# EAGLE design ornithopter (EAGLE 9.6.2)
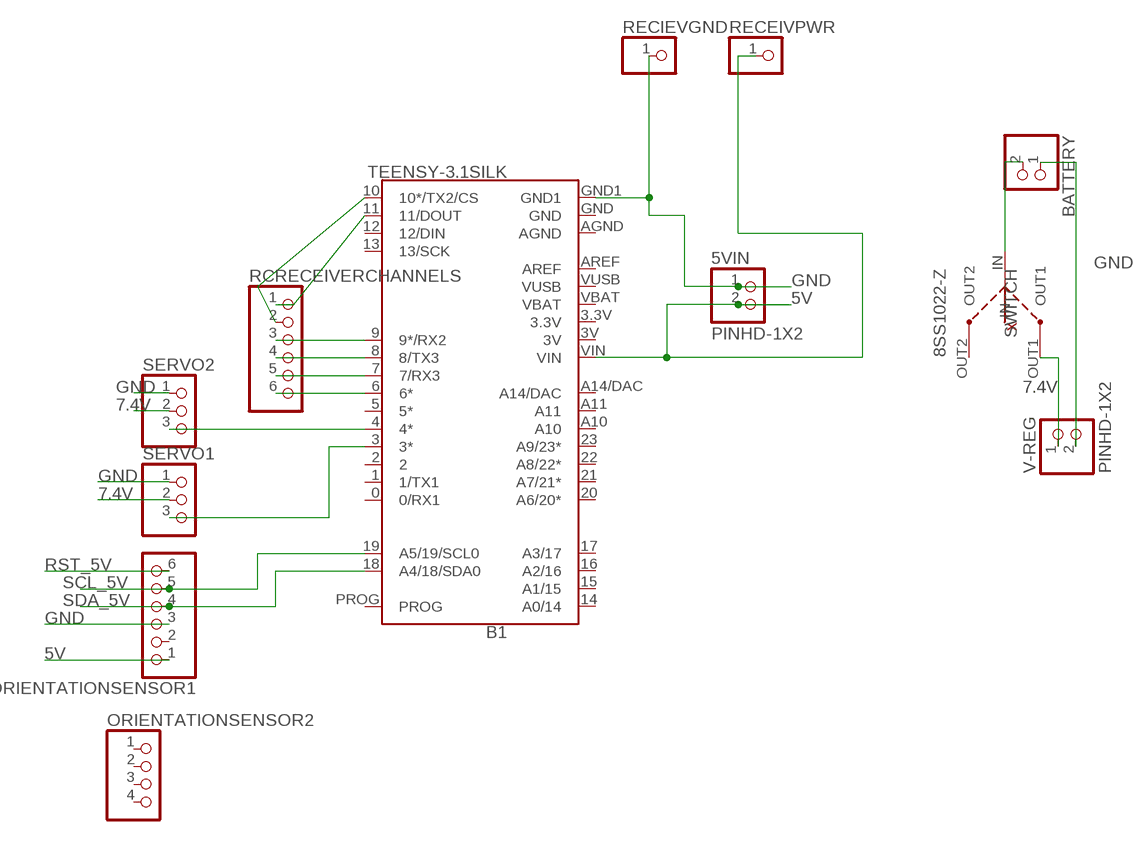
[diagram p0: schematic, sheet 1]

## Parts
5VIN  PINHD-1X2  [1X02]
B1  TEENSY-3.1SILK  [TEENSY-3.1]
BATTERY  PINHD-1X2  [1X02]
ORIENTATIONSENSOR1  HEADER-1X676MIL  [1X06_ROUND_76]
ORIENTATIONSENSOR2  HEADER-1X476MIL  [1X04_ROUND_76]
RCRECEIVERCHANNELS  PINHD-1X6  [1X06]
RECEIVPWR  PINHD-1X1  [1X01]
RECIEVGND  PINHD-1X1  [1X01]
SERVO1  PINHD-1X3CB  [1X03-CLEANBIG]
SERVO2  PINHD-1X3CB  [1X03-CLEANBIG]
SWITCH  8SS1022-Z  [8SS1022-Z]
V-REG  PINHD-1X2  [1X02]

## Nets
5V: 5VIN.2 B1.VIN ORIENTATIONSENSOR1.1 RECEIVPWR.1
7.4V: SERVO1.2 SERVO2.2 SWITCH.OUT1 V-REG.1
GND: 5VIN.1 B1.GND1 BATTERY.1 ORIENTATIONSENSOR1.3 RECIEVGND.1 SERVO1.1 SERVO2.1 V-REG.2
N$1: B1.11(11/DOUT) RCRECEIVERCHANNELS.1
N$2: B1.10(10*/TX2/CS) RCRECEIVERCHANNELS.2
N$3: B1.9(9*/RX2) RCRECEIVERCHANNELS.3
N$4: B1.8(8/TX3) RCRECEIVERCHANNELS.4
N$5: B1.7(7/RX3) RCRECEIVERCHANNELS.5
N$6: B1.6(6*) RCRECEIVERCHANNELS.6
N$7: B1.4(4*) SERVO2.3
N$8: B1.3(3*) SERVO1.3
N$9: BATTERY.2 SWITCH.IN
RST_5V: ORIENTATIONSENSOR1.6
SCL_5V: B1.19(A5/19/SCL0) ORIENTATIONSENSOR1.5
SDA_5V: B1.18(A4/18/SDA0) ORIENTATIONSENSOR1.4
Unconnected: B1.0(0/RX1) B1.1(1/TX1) B1.2 B1.5(5*) B1.12(12/DIN) B1.13(13/SCK) B1.14(A0/14) B1.15(A1/15) B1.16(A2/16) B1.17(A3/17) B1.20(A6/20*) B1.21(A7/21*) B1.22(A8/22*) B1.23(A9/23*) B1.A10 B1.A11 B1.A14/DAC B1.AREF B1.PROG ORIENTATIONSENSOR1.2 ORIENTATIONSENSOR2.1 ORIENTATIONSENSOR2.2 ORIENTATIONSENSOR2.3 ORIENTATIONSENSOR2.4 SWITCH.OUT2

## Power pins joined to a net without a drawn wire
3.3V: B1.3.3V
3V: B1.3V
AGND: B1.AGND
GND: B1.GND
VBAT: B1.VBAT
VUSB: B1.VUSB

## Library data of the parts
5VIN BATTERY V-REG = Connector:PINHD-1X2: PIN HEADER; CATEGORY: CONNECTOR; SUB-CATEGORY: PIN-HEADER
B1 = SparkFun-Boards:TEENSY-3.1: Teensy 3+ Footprint Mechanical footprint with connectors for Teensy Development Board with ARM Cortex. SparkFun Products: Teensy 3.2 <https://www.sparkfun.com/products/13736> Teensy LC <https://www.sparkfun.com/products/13305>; SF_ID: DEV-12646
ORIENTATIONSENSOR1 = microbuilder:HEADER-1X6: PIN HEADER
ORIENTATIONSENSOR2 = microbuilder:HEADER-1X4: PIN HEADER
RCRECEIVERCHANNELS = adafruit:PINHD-1X6: PIN HEADER
RECEIVPWR RECIEVGND = pinhead:PINHD-1X1: PIN HEADER
SERVO1 SERVO2 = adafruit:PINHD-1X3: PIN HEADER
SWITCH = ornithopter:8SS1022-Z

## Board
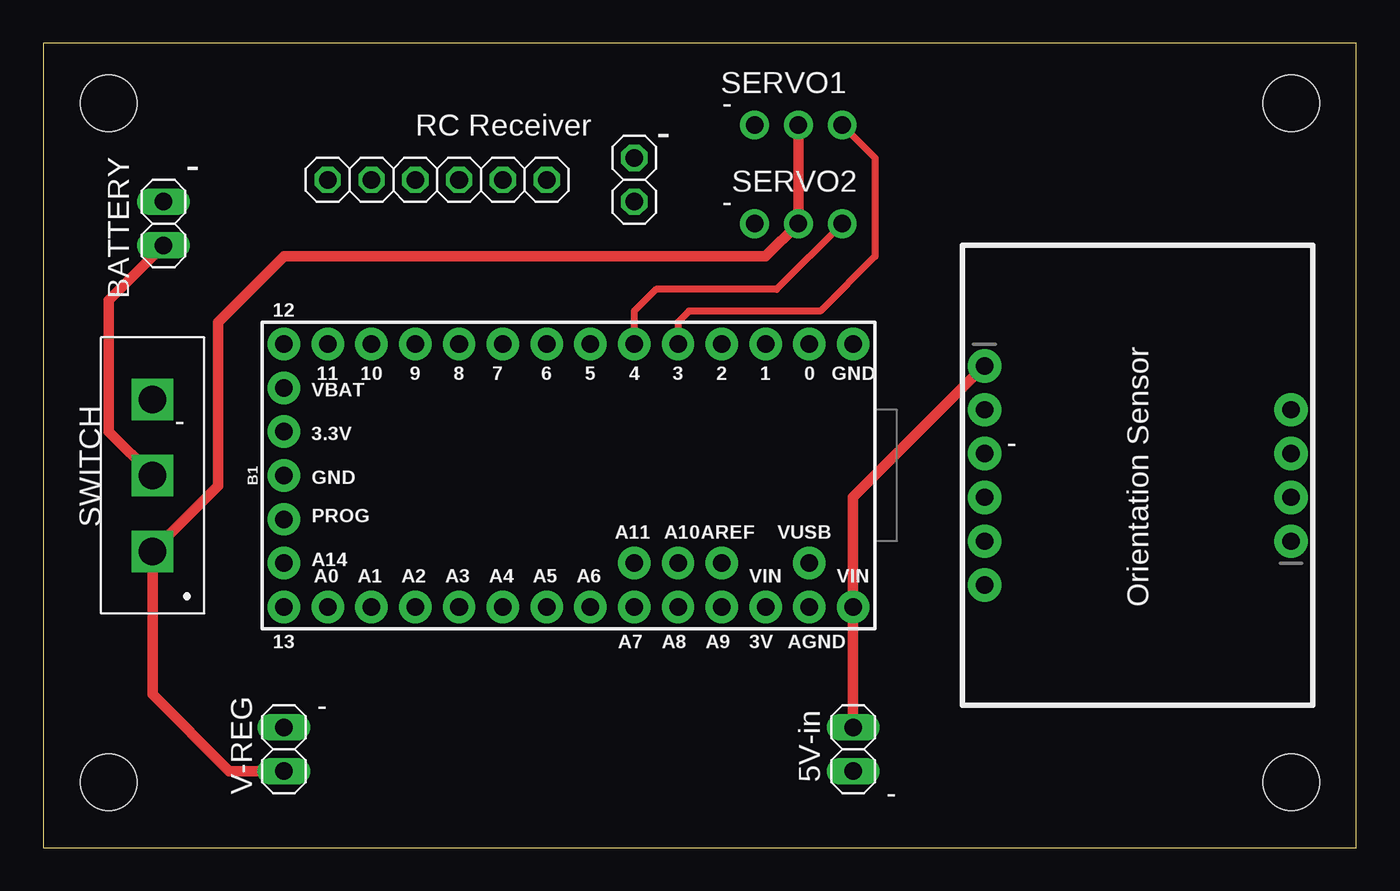
[diagram p1: board, top side]
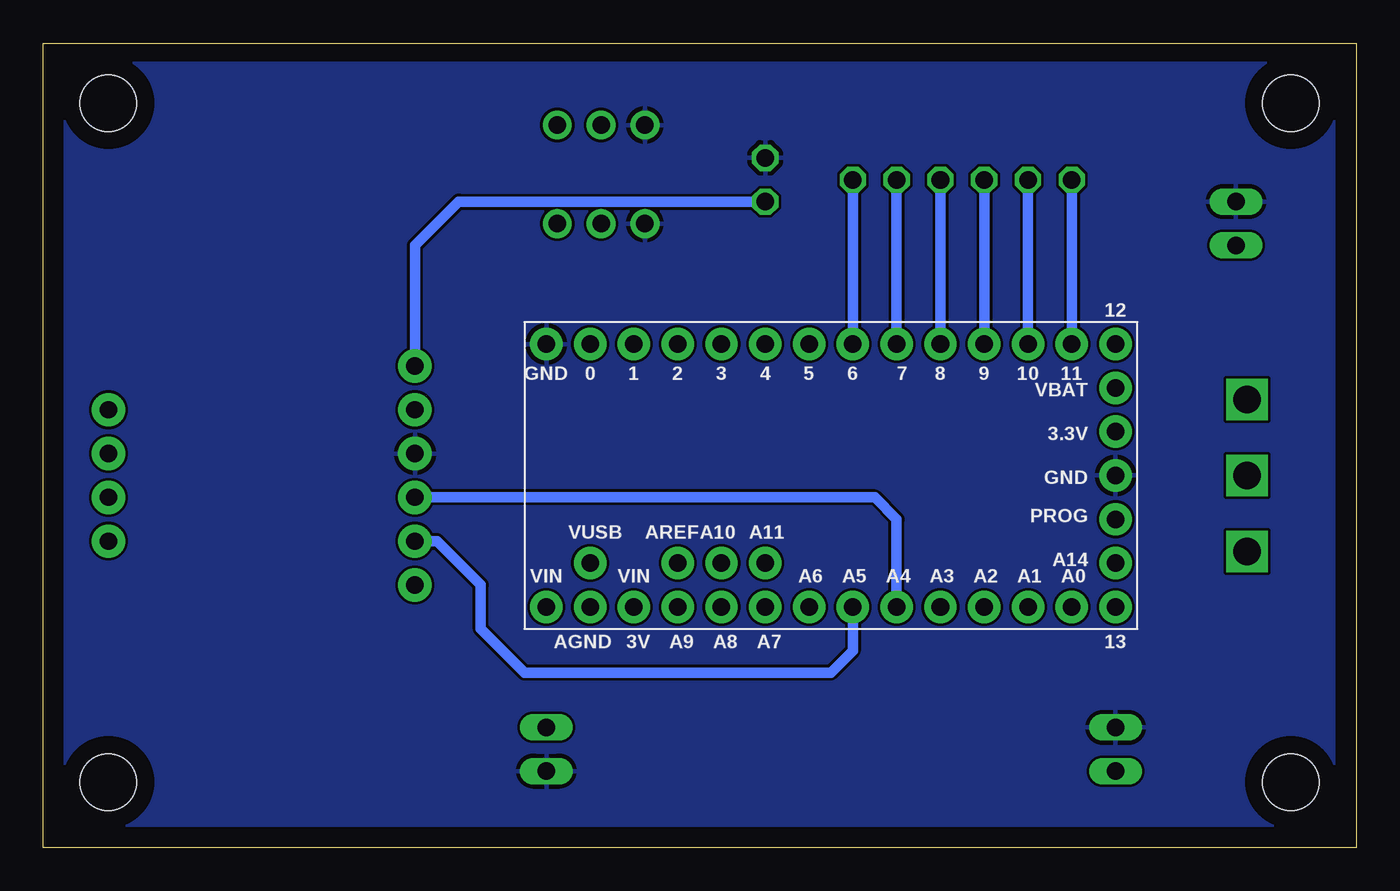
[diagram p2: board, bottom side, seen from below]

Size 76.18 x 46.66 mm. Coordinates in mm from the lower left corner, seen from the top.
Outline: 0,0 76.18,0 76.18,46.66 0,46.66 0,0
Copper layers (1*16): Top 0.035mm / dielectric 1.5mm / Bottom 0.035mm
Design rules "default": minimum track width 6mil, minimum drill 0.35mm, track to track 6mil, track to pad 6mil, pad to pad 6mil, via to via 6mil, smd to smd 6mil, copper to edge 40mil, drill to drill 6mil, minimum pad ring 10mil, minimum via ring 8mil, stop-mask expansion 4mil, vias tented up to drill 0mil, thermal gap 10mil
Holes 3.26 mm at 3.81,43.18 3.81,3.81 72.39,3.81 72.39,43.18

### Footprints (pad centres in the part's own frame; a part is rotated, then mirrored left to right if it is on the bottom)
1X02 = drill 1.016 long: 1 -1.27,0; 2 1.27,0
TEENSY-3.1 = drill 1.016 pad 1.88: 0 7.62,-13.97; 1 7.62,-11.43; 2 7.62,-8.89; 3 7.62,-6.35; 3.3V 2.54,16.51; 3V -7.62,-11.43; 4 7.62,-3.81; 5 7.62,-1.27; 6 7.62,1.27; 7 7.62,3.81; 8 7.62,6.35; 9 7.62,8.89; 10 7.62,11.43; 11 7.62,13.97; 12 7.62,16.51; 13 -7.62,16.51; 14 -7.62,13.97; 15 -7.62,11.43; 16 -7.62,8.89; 17 -7.62,6.35; 18 -7.62,3.81; 19 -7.62,1.27; 20 -7.62,-1.27; 21 -7.62,-3.81; 22 -7.62,-6.35; 23 -7.62,-8.89; A10 -5.08,-6.35; A11 -5.08,-3.81; A14/DAC -5.08,16.51; AGND -7.62,-13.97; AREF -5.08,-8.89; GND 0,16.51; GND1 7.62,-16.51; PROG -2.54,16.51; VBAT 5.08,16.51; VIN -7.62,-16.51; VUSB -5.08,-13.97
1X06_ROUND_76 = drill 1 pad 1.93: 1 -6.35,0; 2 -3.81,0; 3 -1.27,0; 4 1.27,0; 5 3.81,0; 6 6.35,0
1X04_ROUND_76 = drill 1 pad 1.93: 1 -3.81,0; 2 -1.27,0; 3 1.27,0; 4 3.81,0
1X06 = drill 1.016 octagon: 1 -6.35,0; 2 -3.81,0; 3 -1.27,0; 4 1.27,0; 5 3.81,0; 6 6.35,0
1X01 = drill 1.016 octagon: 1 0,0
1X03-CLEANBIG = drill 1.016 pad 1.676: 1 -2.54,0; 2 0,0; 3 2.54,0
8SS1022-Z = drill 1.6 square: IN 0,0; OUT1 -4.4,0; OUT2 4.4,0

### Placement (x,y rotation side)
5VIN  46.99,5.71 90 top
B1  30.48,21.59 90 top
BATTERY  6.98,36.2 270 top
ORIENTATIONSENSOR1  54.61,21.59 270 top
ORIENTATIONSENSOR2  72.39,21.59 90 top
RCRECEIVERCHANNELS  22.86,38.73 0 top
RECEIVPWR  34.29,37.46 0 top
RECIEVGND  34.29,40.01 0 top
SERVO1  43.81,41.91 0 top
SERVO2  43.81,36.2 0 top
SWITCH  6.35,21.59 90 top
V-REG  13.97,5.71 90 top

### Tracks (layer width: path | path; a pad name or v marks a point on that pad's centre or on a via)
5V
  Top 0.61: ORIENTATIONSENSOR1.1 46.99,20.32 B1.VIN 5VIN.2
  Bottom 0.61: ORIENTATIONSENSOR1.1 54.61,34.92 52.07,37.46 RECEIVPWR.1
7.4V
  Top 0.61: SERVO1.2 SERVO2.2 41.91,34.29 13.97,34.29 10.16,30.48 10.16,21 SWITCH.OUT1 6.35,8.89 10.79,4.45 V-REG.1
GND
  pour Bottom: 1.27,45.72 1.27,1.27 74.93,1.27 74.93,45.72
N$1
  Bottom 0.61: RCRECEIVERCHANNELS.1 B1.11
N$2
  Bottom 0.61: RCRECEIVERCHANNELS.2 B1.10
N$3
  Bottom 0.61: RCRECEIVERCHANNELS.3 B1.9
N$4
  Bottom 0.61: RCRECEIVERCHANNELS.4 B1.8
N$5
  Bottom 0.61: RCRECEIVERCHANNELS.5 B1.7
N$6
  Bottom 0.61: RCRECEIVERCHANNELS.6 B1.6
N$7
  Top 0.406: SERVO2.3 42.54,32.38 35.56,32.38 34.29,31.12 B1.4
N$8
  Top 0.406: SERVO1.3 48.26,40.01 48.26,34.29 45.08,31.12 37.46,31.12 36.83,30.48 B1.3
N$9
  Top 0.61: SWITCH.IN 3.81,24.13 3.81,31.75 BATTERY.2
SCL_5V
  Bottom 0.61: B1.19 29.21,11.43 30.48,10.16 48.26,10.16 50.8,12.7 50.8,15.24 53.34,17.78 ORIENTATIONSENSOR1.5
SDA_5V
  Bottom 0.61: B1.18 26.67,19.05 27.94,20.32 ORIENTATIONSENSOR1.4

### Text on the board
tNames: - | RC Receiver | - | - | - | - | - | Orientation Sensor | - | 5V-in | -